# EAGLE schematic A20-SOM-EVB_Rev_C1 (EAGLE 4.16)
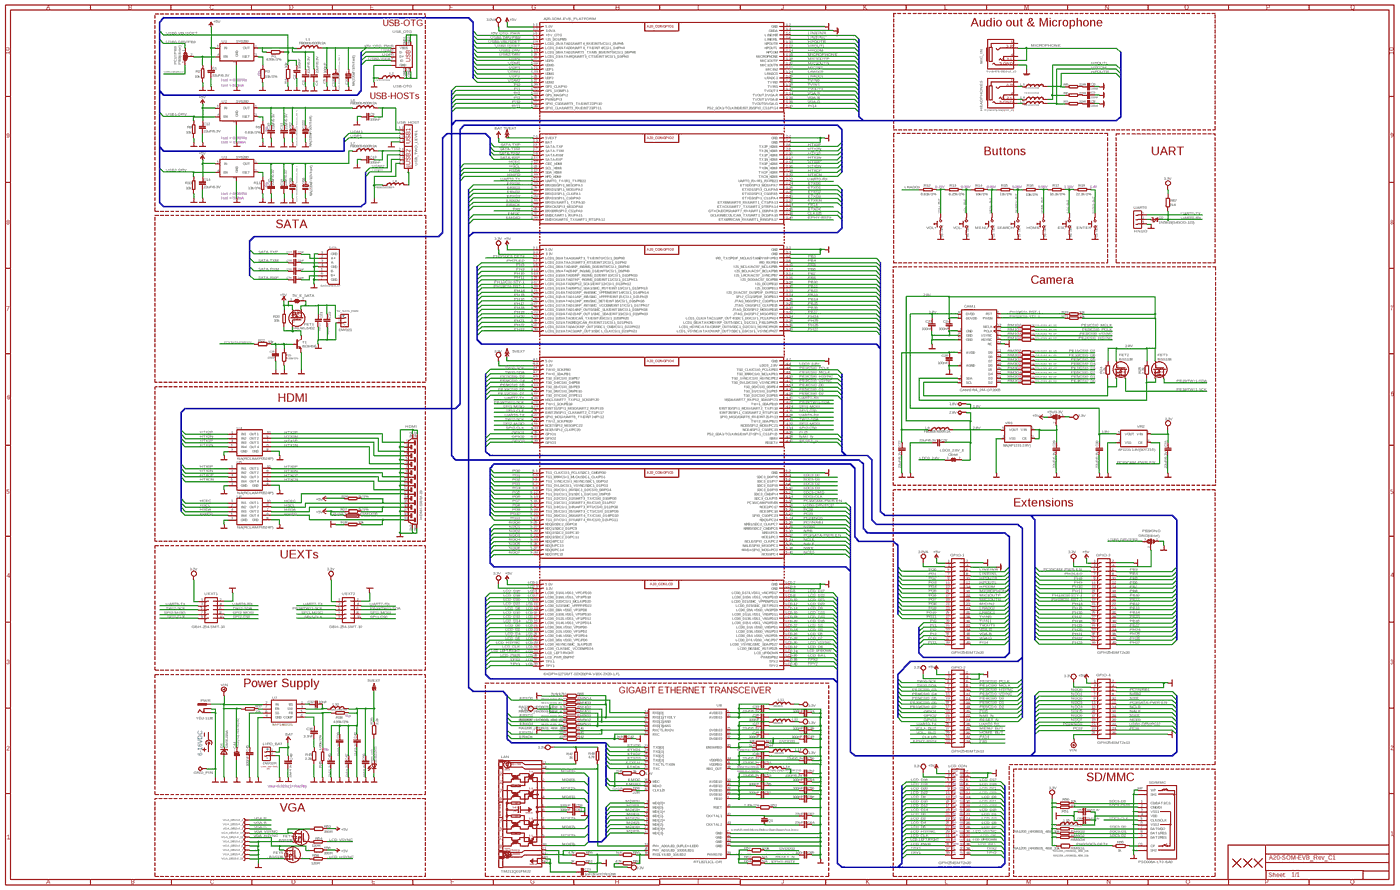
[diagram p0: schematic, sheet 1, overview]
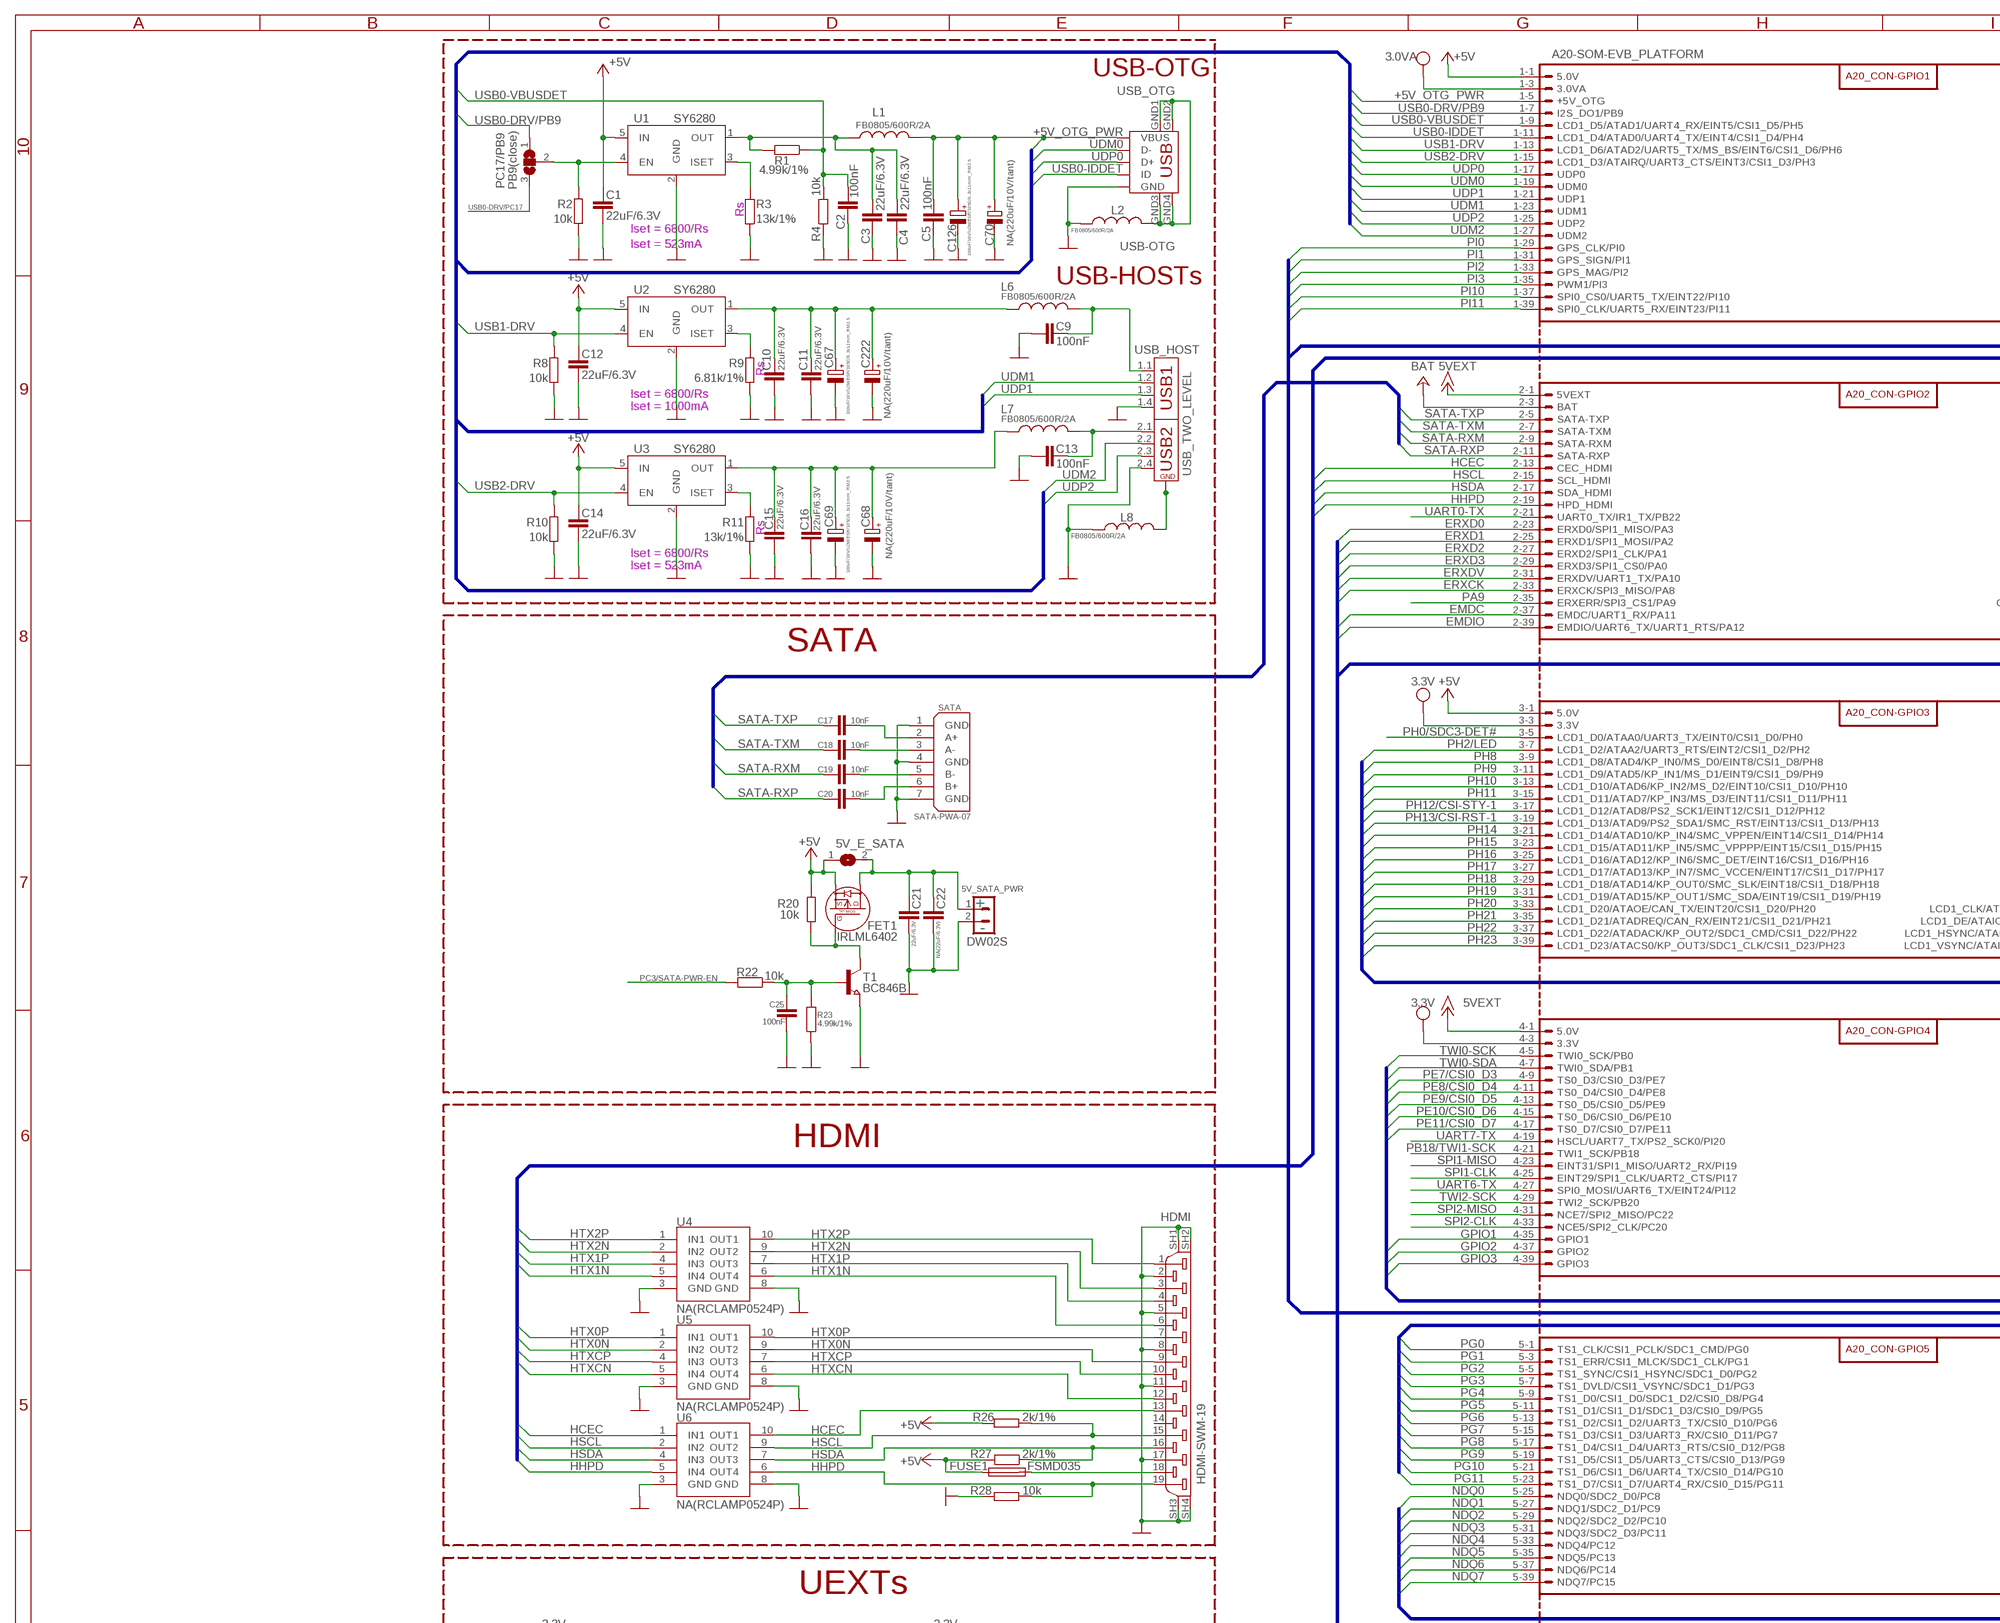
[diagram p1: schematic, sheet 1, part 1 of 4]
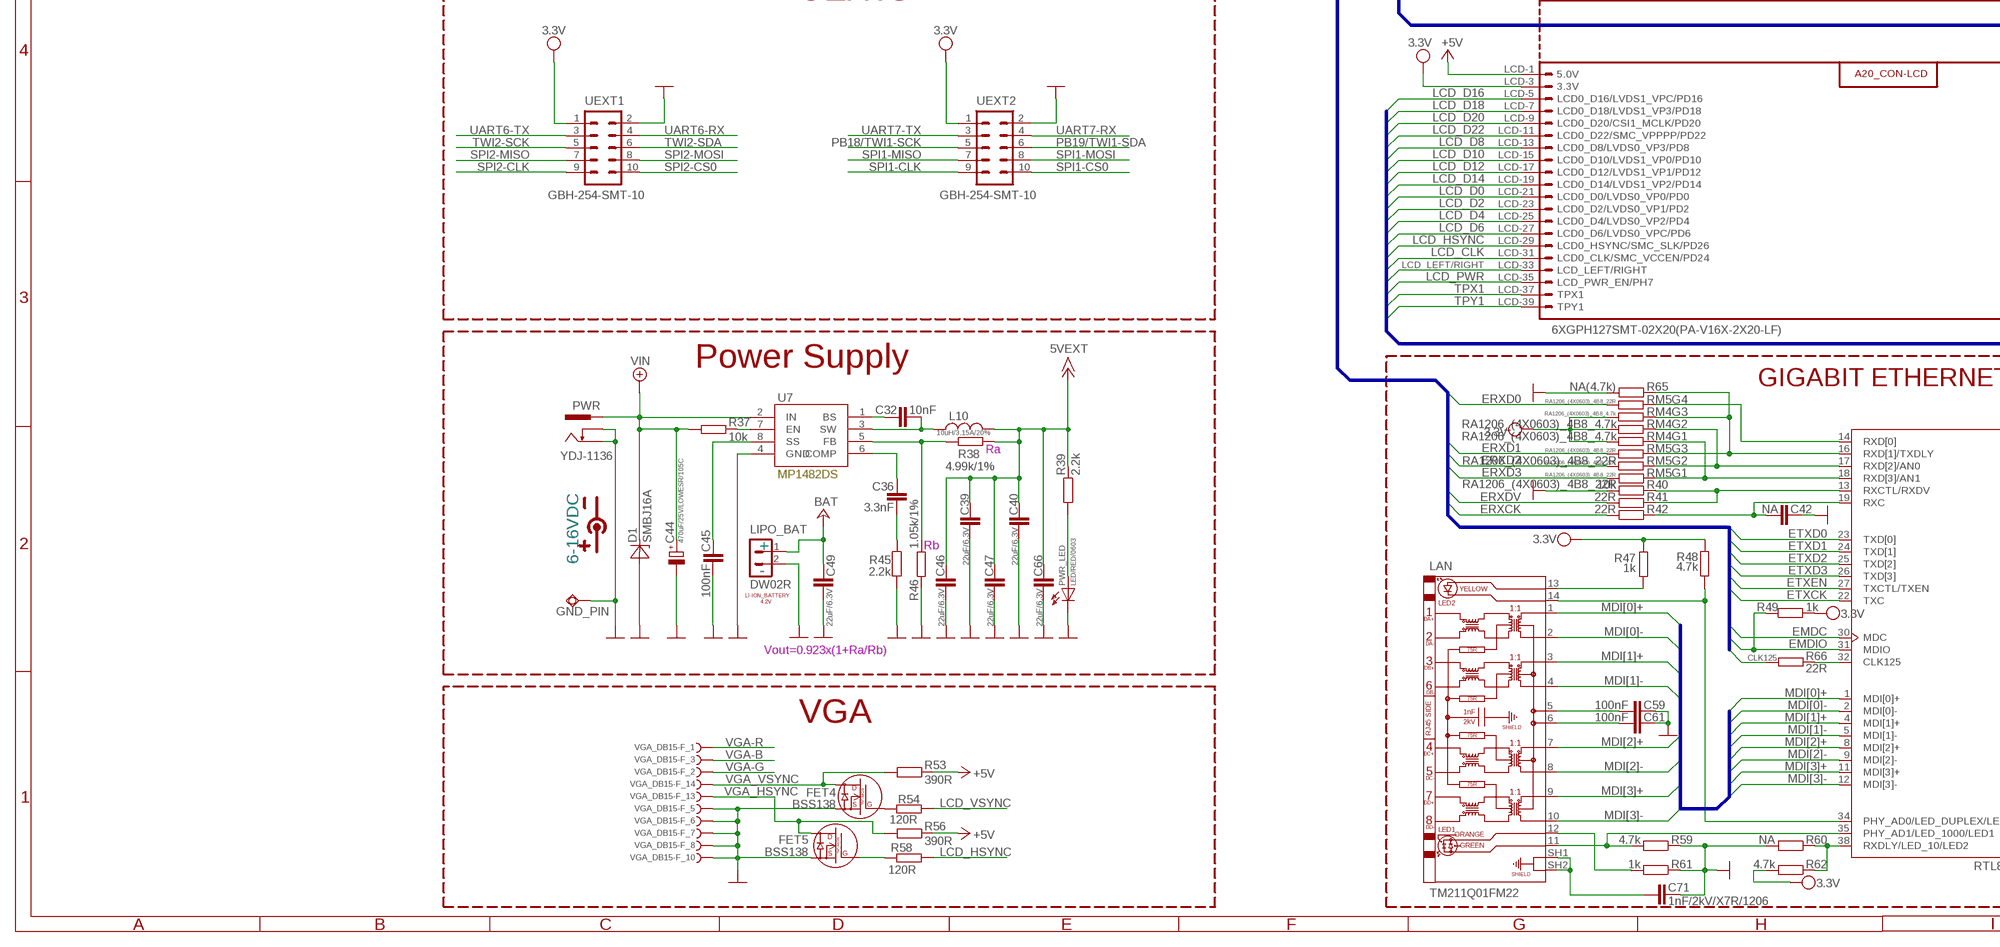
[diagram p2: schematic, sheet 1, part 2 of 4]
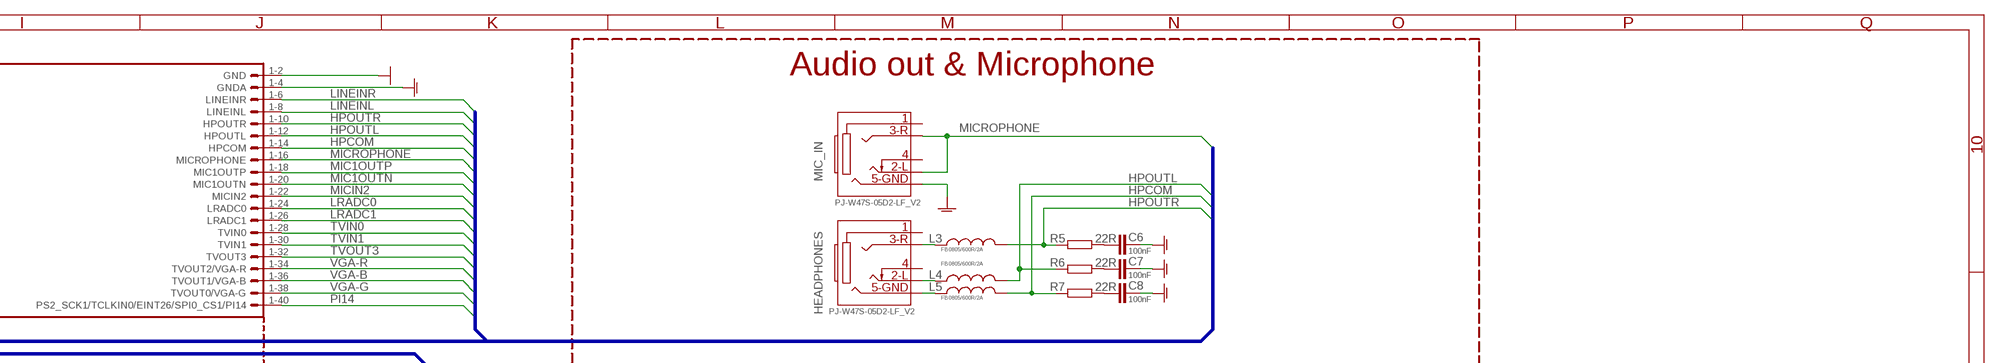
[diagram p3: schematic, sheet 1, part 3 of 4]
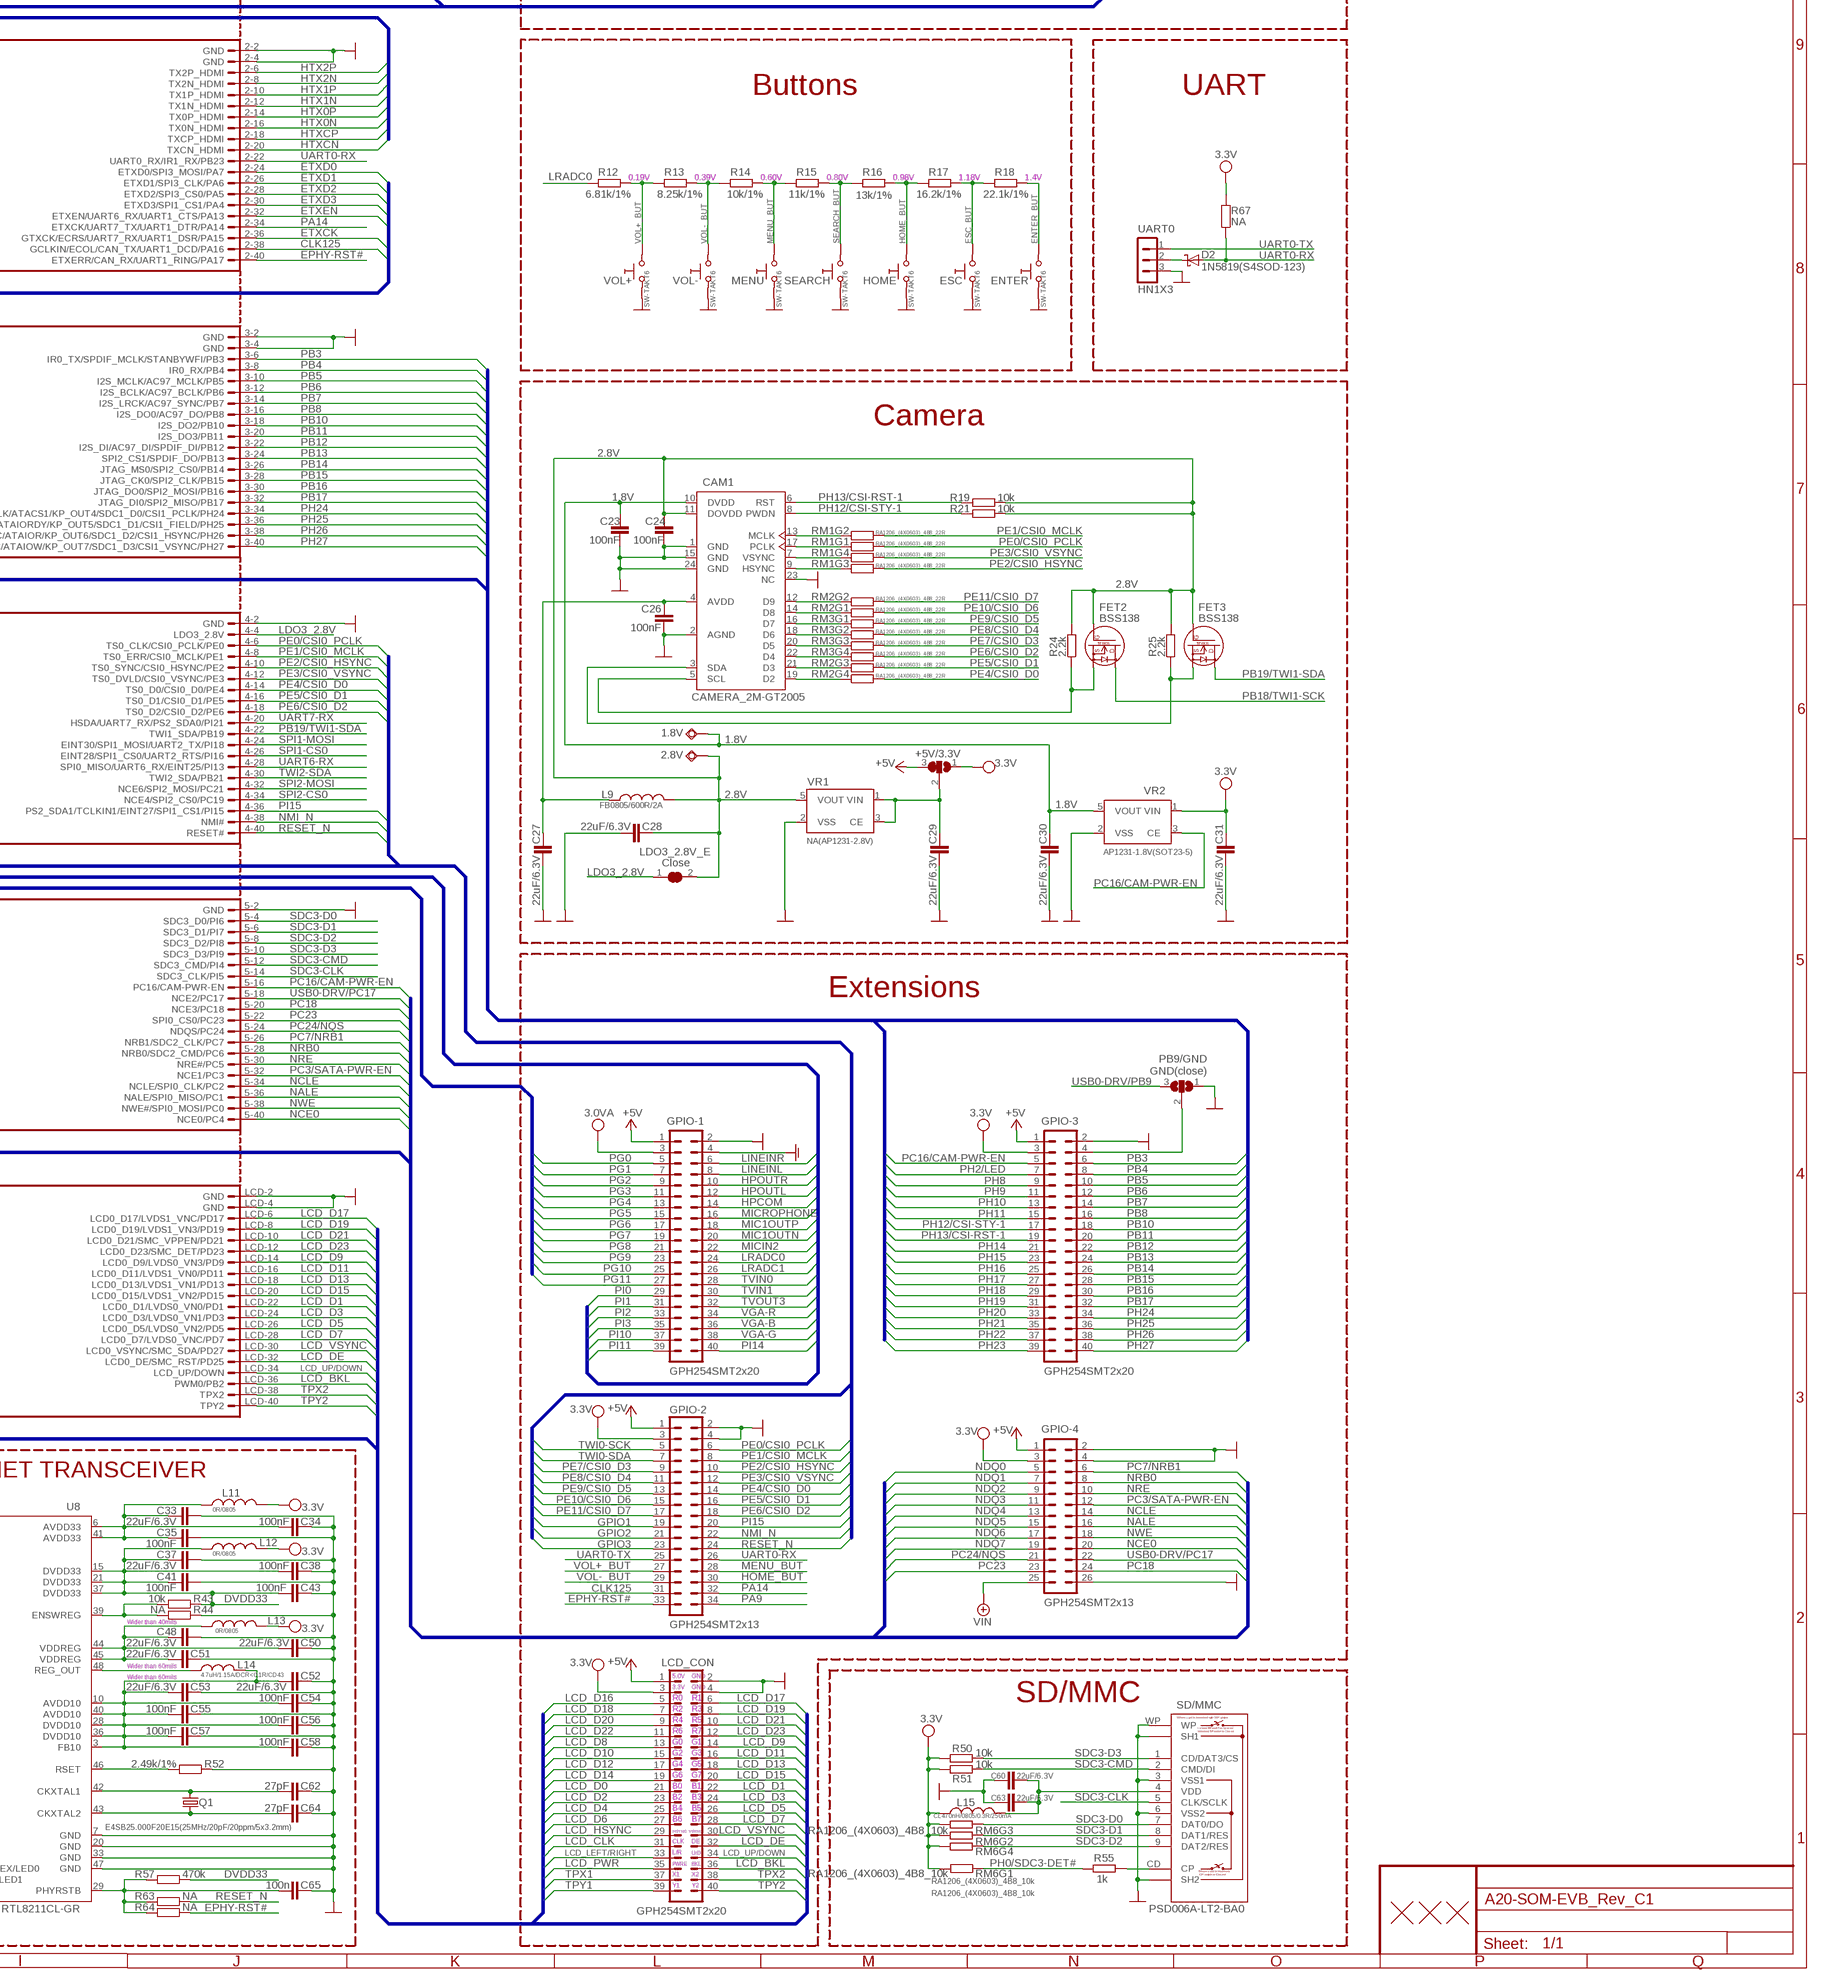
[diagram p4: schematic, sheet 1, part 4 of 4]

## Parts
1.8V  TESTPAD80/40  [SMD80/40]
2.8V  TESTPAD80/40  [SMD80/40]
5V_E_SATA  SJSJ_SMALLER  [SJ_1_SMALLER]
5V_SATA_PWR  DW02S  CON2DW02S  [DW02S]
+5V/3.3V  SJ2W8  [SJ_2_SMALLER_23_TIED]
A20-SOM-EVB_PLATFORM  6XGPH127SMT-02X20(PA-V16X-2X20-LF)  A20-SOM-EVB---6XGPH127SMT-02X20(PA-V16X-2X20-LF)  [A20-SOM-EVB]
C1  22uF/6.3V  C-EUC0603_DWS  [C0603_DWS]
C2  100nF  C-EUC0603_DWS  [C0603_DWS]
C3  22uF/6.3V  C-EUC0603_DWS  [C0603_DWS]
C4  22uF/6.3V  C-EUC0603_DWS  [C0603_DWS]
C5  100nF  C-EUC0603_DWS  [C0603_DWS]
C6  100nF  C-EUC0603_DWS  [C0603_DWS]
C7  100nF  C-EUC0603_DWS  [C0603_DWS]
C8  100nF  C-EUC0603_DWS  [C0603_DWS]
C9  100nF  C-EUC0603_DWS  [C0603_DWS]
C10  22uF/6.3V  C-EUC0603_DWS  [C0603_DWS]
C11  22uF/6.3V  C-EUC0603_DWS  [C0603_DWS]
C12  22uF/6.3V  C-EUC0603_DWS  [C0603_DWS]
C13  100nF  C-EUC0603_DWS  [C0603_DWS]
C14  22uF/6.3V  C-EUC0603_DWS  [C0603_DWS]
C15  22uF/6.3V  C-EUC0603_DWS  [C0603_DWS]
C16  22uF/6.3V  C-EUC0603_DWS  [C0603_DWS]
C17  10nF  C-EUC0603_DWS  [C0603_DWS]
C18  10nF  C-EUC0603_DWS  [C0603_DWS]
C19  10nF  C-EUC0603_DWS  [C0603_DWS]
C20  10nF  C-EUC0603_DWS  [C0603_DWS]
C21  22uF/6.3V  C-EUC0603_DWS  [C0603_DWS]
C22  NA(22uF/6.3V)  C-EUC0603_DWS  [C0603_DWS]
C23  100nF  C-EUC0603_DWS  [C0603_DWS]
C24  100nF  C-EUC0603_DWS  [C0603_DWS]
C25  100nF  C-EUC0603_DWS  [C0603_DWS]
C26  100nF  C-EUC0603_DWS  [C0603_DWS]
C27  22uF/6.3V  C-EUC0603_DWS  [C0603_DWS]
C28  22uF/6.3V  C-EUC0603_DWS  [C0603_DWS]
C29  22uF/6.3V  C-EUC0603_DWS  [C0603_DWS]
C30  22uF/6.3V  C-EUC0603_DWS  [C0603_DWS]
C31  22uF/6.3V  C-EUC0603_DWS  [C0603_DWS]
C32  10nF  C-EUC0603_DWS  [C0603_DWS]
C33  22uF/6.3V  C-EUC0603_DWS  [C0603_DWS]
C34  100nF  C-EUC0603_DWS  [C0603_DWS]
C35  100nF  C-EUC0603_DWS  [C0603_DWS]
C36  3.3nF  C-EUC0603_DWS  [C0603_DWS]
C37  22uF/6.3V  C-EUC0603_DWS  [C0603_DWS]
C38  100nF  C-EUC0603_DWS  [C0603_DWS]
C39  22uF/6.3V  C-EUC0603_DWS  [C0603_DWS]
C40  22uF/6.3V  C-EUC0603_DWS  [C0603_DWS]
C41  100nF  C-EUC0603_DWS  [C0603_DWS]
C42  NA  C-EUC0603_DWS  [C0603_DWS]
C43  100nF  C-EUC0603_DWS  [C0603_DWS]
C44  470uF/25V/LOWESR/105C  CPOL-EUE3.5-8  [E3,5-8]
C45  100nF  C-EUC0603_DWS  [C0603_DWS]
C46  22uF/6.3V  C-EUC0603_DWS  [C0603_DWS]
C47  22uF/6.3V  C-EUC0603_DWS  [C0603_DWS]
C48  22uF/6.3V  C-EUC0603_DWS  [C0603_DWS]
C49  22uF/6.3V  C-EUC0603_DWS  [C0603_DWS]
C50  22uF/6.3V  C-EUC0603_DWS  [C0603_DWS]
C51  22uF/6.3V  C-EUC0603_DWS  [C0603_DWS]
C52  22uF/6.3V  C-EUC0603_DWS  [C0603_DWS]
C53  22uF/6.3V  C-EUC0603_DWS  [C0603_DWS]
C54  100nF  C-EUC0603_DWS  [C0603_DWS]
C55  100nF  C-EUC0603_DWS  [C0603_DWS]
C56  100nF  C-EUC0603_DWS  [C0603_DWS]
C57  100nF  C-EUC0603_DWS  [C0603_DWS]
C58  100nF  C-EUC0603_DWS  [C0603_DWS]
C59  100nF  C-EUC0603_DWS  [C0603_DWS]
C60  22uF/6.3V  C-EUC0603_DWS  [C0603_DWS]
C61  100nF  C-EUC0603_DWS  [C0603_DWS]
C62  27pF  C-EUC0603_DWS  [C0603_DWS]
C63  22uF/6.3V  C-EUC0603_DWS  [C0603_DWS]
C64  27pF  C-EUC0603_DWS  [C0603_DWS]
C65  100n  C-EUC0603_DWS  [C0603_DWS]
C66  22uF/6.3V  C-EUC0603_DWS  [C0603_DWS]
C67  100uF/16V/LOWESR/105C/6.3x11mm_RM2.5  CPOL-EUE2.5-6.3  [E2,5-6,3]
C68  NA(220uF/10V/tant)  CPOL-EUCT7343  [CT7343]
C69  100uF/16V/LOWESR/105C/6.3x11mm_RM2.5  CPOL-EUE2.5-6.3  [E2,5-6,3]
C70  NA(220uF/10V/tant)  CPOL-EUCT7343  [CT7343]
C71  1nF/2kV/X7R/1206  C-EUC1206_5MILS_WS_ISO  [C1206_5MILS_WS_ISO]
C126  100uF/16V/LOWESR/105C/6.3x11mm_RM2.5  CPOL-EUE2.5-6.3  [E2,5-6,3]
C222  NA(220uF/10V/tant)  CPOL-EUCT7343  [CT7343]
CAM1  CAMERA_2M-GT2005  [CAM_2M_GT2005]
D1  SMBJ16A  [DO214AA]
D2  1N5819(S4SOD-123)  SCHOTKKY7.62SS-1N5819(S4SOD-123)  [SOD-123]
ENTER  SW-TAKT6  [SW-TAKT_6X3.5_SMD]
ESC  SW-TAKT6  [SW-TAKT_6X3.5_SMD]
FET1  IRLML6402  P-MOS+DIODIRLML6402  [SOT23]
FET2  BSS138  N-MOS+DIODBSS138(SOT23-3)  [SOT23]
FET3  BSS138  N-MOS+DIODBSS138(SOT23-3)  [SOT23]
FET4  BSS138  N-MOS+DIODBSS138(SOT23-3)  [SOT23]
FET5  BSS138  N-MOS+DIODBSS138(SOT23-3)  [SOT23]
FID1  FIDUCIAL  [FIDUCIAL-1X3]
FID2  FIDUCIAL  [FIDUCIAL-1X3]
FID3  FIDUCIAL  [FIDUCIAL-1X3]
FUSE1  FSMD035  FUSE  [1206]
GND_PIN  TESTPAD3  [TEST_PAD40/70/SQUARE]
GPIO-1  GPH254SMT2x20  ML40-GBH-254-SMT-40  [ML40-MALE(GBH-254-SMT-40)]
GPIO-2  GPH254SMT2x13  ML34-(GBH-254-SMT-34)  [ML34-MALE(GBH-254-SMT-34)]
GPIO-3  GPH254SMT2x20  ML40-GBH-254-SMT-40  [ML40-MALE(GBH-254-SMT-40)]
GPIO-4  GPH254SMT2x13  ML26-(GBH-254-SMT-26)  [ML26-MALE(GBH-254-SMT-26)]
HDMI  HDMI-SWM-19  HDMI-MC34931HDMI-SWM-19  [HDMI-SWM-19]
HEADPHONES  PJ-W47S-05D2-LF_V2  AUDIO_JACK_5PINPJ-W47S-05D2-LF_V2  [PJ-W47S-05D2-LF_5PIN_V2]
HOME  SW-TAKT6  [SW-TAKT_6X3.5_SMD]
L1  FB0805/600R/2A  L-USL0805_5MIL_DWS  [L0805_5MIL_DWS]
L2  FB0805/600R/2A  L-USL0805_5MIL_DWS  [L0805_5MIL_DWS]
L3  FB0805/600R/2A  L-USL0805_5MIL_DWS  [L0805_5MIL_DWS]
L4  FB0805/600R/2A  L-USL0805_5MIL_DWS  [L0805_5MIL_DWS]
L5  FB0805/600R/2A  L-USL0805_5MIL_DWS  [L0805_5MIL_DWS]
L6  FB0805/600R/2A  L-USL0805_5MIL_DWS  [L0805_5MIL_DWS]
L7  FB0805/600R/2A  L-USL0805_5MIL_DWS  [L0805_5MIL_DWS]
L8  FB0805/600R/2A  L-USL0805_5MIL_DWS  [L0805_5MIL_DWS]
L9  FB0805/600R/2A  L-USL0805_5MIL_DWS  [L0805_5MIL_DWS]
L10  10uH/3.15A/20%  LL  [8X7MM_3131]
L11  0R/0805  L-USL0805_5MIL_DWS  [L0805_5MIL_DWS]
L12  0R/0805  L-USL0805_5MIL_DWS  [L0805_5MIL_DWS]
L13  0R/0805  L-USL0805_5MIL_DWS  [L0805_5MIL_DWS]
L14  4.7uH/1.15A/DCR<0.1R/CD43  L-CD42(43)  [CD42(43)]
L15  CL470nH/0805/0.3R/250mA  L-USL0805_5MIL_DWS  [L0805_5MIL_DWS]
LAN  TM211Q01FM22  TM211Q01FM22_SH  [TM211Q01FM22_SH]
LCD_CON  GPH254SMT2x20  ML40-GBH-254-SMT-40  [ML40-MALE(GBH-254-SMT-40)]
LDO3_2.8V_E  Close  SJSJ_1_SMALLER_CLOSE  [SJ_1_SMALLER_CLOSE]
LIPO_BAT  DW02R  CON2DW02R  [DW02R]
MENU  SW-TAKT6  [SW-TAKT_6X3.5_SMD]
MIC_IN  PJ-W47S-05D2-LF_V2  AUDIO_JACK_5PINPJ-W47S-05D2-LF_V2  [PJ-W47S-05D2-LF_5PIN_V2]
PB9/GND  GND(close)  SJ2W3  [SJ_2_SMALL]
PC17/PB9  PB9(close)  SJ2W3  [SJ_2_SMALL]
PWR  YDJ-1136  PWR-JAKPWR_JACK_UNI_MILLING  [PWR_JACK_UNI_MILLING]
PWR_LED  LED/RED/0603  LED0603DWS  [LED-0603]
Q1  E4SB25.000F20E15(25MHz/20pF/20ppm/5x3.2mm)  HC49/S_E4SB25.000F20E15  [HCX-4S]
R1  4.99k/1%  R-EU_R0603_5MIL_DWS  [R0603_5MIL_DWS]
R2  10k  R-EU_R0603_5MIL_DWS  [R0603_5MIL_DWS]
R3  13k/1%  R-EU_R0603_5MIL_DWS  [R0603_5MIL_DWS]
R4  10k  R-EU_R0603_5MIL_DWS  [R0603_5MIL_DWS]
R5  22R  R-EU_R0603_5MIL_DWS  [R0603_5MIL_DWS]
R6  22R  R-EU_R0603_5MIL_DWS  [R0603_5MIL_DWS]
R7  22R  R-EU_R0603_5MIL_DWS  [R0603_5MIL_DWS]
R8  10k  R-EU_R0603_5MIL_DWS  [R0603_5MIL_DWS]
R9  6.81k/1%  R-EU_R0603_5MIL_DWS  [R0603_5MIL_DWS]
R10  10k  R-EU_R0603_5MIL_DWS  [R0603_5MIL_DWS]
R11  13k/1%  R-EU_R0603_5MIL_DWS  [R0603_5MIL_DWS]
R12  6.81k/1%  R-EU_R0603_5MIL_DWS  [R0603_5MIL_DWS]
R13  8.25k/1%  R-EU_R0603_5MIL_DWS  [R0603_5MIL_DWS]
R14  10k/1%  R-EU_R0603_5MIL_DWS  [R0603_5MIL_DWS]
R15  11k/1%  R-EU_R0603_5MIL_DWS  [R0603_5MIL_DWS]
R16  13k/1%  R-EU_R0603_5MIL_DWS  [R0603_5MIL_DWS]
R17  16.2k/1%  R-EU_R0603_5MIL_DWS  [R0603_5MIL_DWS]
R18  22.1k/1%  R-EU_R0603_5MIL_DWS  [R0603_5MIL_DWS]
R19  10k  R-EU_R0603_5MIL_DWS  [R0603_5MIL_DWS]
R20  10k  R-EU_R0603_5MIL_DWS  [R0603_5MIL_DWS]
R21  10k  R-EU_R0603_5MIL_DWS  [R0603_5MIL_DWS]
R22  10k  R-EU_R0603_5MIL_DWS  [R0603_5MIL_DWS]
R23  4.99k/1%  R-EU_R0603_5MIL_DWS  [R0603_5MIL_DWS]
R24  2.2k  R-EU_R0603_5MIL_DWS  [R0603_5MIL_DWS]
R25  2.2k  R-EU_R0603_5MIL_DWS  [R0603_5MIL_DWS]
R26  2k/1%  R-EU_R0603_5MIL_DWS  [R0603_5MIL_DWS]
R27  2k/1%  R-EU_R0603_5MIL_DWS  [R0603_5MIL_DWS]
R28  10k  R-EU_R0603_5MIL_DWS  [R0603_5MIL_DWS]
R37  10k  R-EU_R0603_5MIL_DWS  [R0603_5MIL_DWS]
R38  4.99k/1%  R-EU_R0603_5MIL_DWS  [R0603_5MIL_DWS]
R39  2.2k  R-EU_R0603_5MIL_DWS  [R0603_5MIL_DWS]
R40  10k  R-EU_R0603_5MIL_DWS  [R0603_5MIL_DWS]
R41  22R  R-EU_R0603_5MIL_DWS  [R0603_5MIL_DWS]
R42  22R  R-EU_R0603_5MIL_DWS  [R0603_5MIL_DWS]
R43  10k  R-EU_R0603_5MIL_DWS  [R0603_5MIL_DWS]
R44  NA  R-EU_R0603_5MIL_DWS  [R0603_5MIL_DWS]
R45  2.2k  R-EU_R0603_5MIL_DWS  [R0603_5MIL_DWS]
R46  1.05k/1%  R-EU_R0603_5MIL_DWS  [R0603_5MIL_DWS]
R47  1k  R-EU_R0603_5MIL_DWS  [R0603_5MIL_DWS]
R48  4.7k  R-EU_R0603_5MIL_DWS  [R0603_5MIL_DWS]
R49  1k  R-EU_R0603_5MIL_DWS  [R0603_5MIL_DWS]
R50  10k  R-EU_R0603_5MIL_DWS  [R0603_5MIL_DWS]
R51  10k  R-EU_R0603_5MIL_DWS  [R0603_5MIL_DWS]
R52  2.49k/1%  R-EU_R0603_5MIL_DWS  [R0603_5MIL_DWS]
R53  390R  R-EU_R0603_5MIL_DWS  [R0603_5MIL_DWS]
R54  120R  R-EU_R0603_5MIL_DWS  [R0603_5MIL_DWS]
R55  1k  R-EU_R0603_5MIL_DWS  [R0603_5MIL_DWS]
R56  390R  R-EU_R0603_5MIL_DWS  [R0603_5MIL_DWS]
R57  470k  R-EU_R0603_5MIL_DWS  [R0603_5MIL_DWS]
R58  120R  R-EU_R0603_5MIL_DWS  [R0603_5MIL_DWS]
R59  4.7k  R-EU_R0603_5MIL_DWS  [R0603_5MIL_DWS]
R60  NA  R-EU_R0603_5MIL_DWS  [R0603_5MIL_DWS]
R61  1k  R-EU_R0603_5MIL_DWS  [R0603_5MIL_DWS]
R62  4.7k  R-EU_R0603_5MIL_DWS  [R0603_5MIL_DWS]
R63  NA  R-EU_R0603_5MIL_DWS  [R0603_5MIL_DWS]
R64  NA  R-EU_R0603_5MIL_DWS  [R0603_5MIL_DWS]
R65  NA(4.7k)  R-EU_R0603_5MIL_DWS  [R0603_5MIL_DWS]
R66  22R  R-EU_R0603_5MIL_DWS  [R0603_5MIL_DWS]
R67  NA  R-EU_R0603_5MIL_DWS  [R0603_5MIL_DWS]
RM1  RA1206_(4X0603)_4B8_22R  R_MATRIX_4E  [R_MATRIX_4]
RM2  RA1206_(4X0603)_4B8_22R  R_MATRIX_4E  [R_MATRIX_4]
RM3  RA1206_(4X0603)_4B8_22R  R_MATRIX_4E  [R_MATRIX_4]
RM4  RA1206_(4X0603)_4B8_4.7k  R_MATRIX_4E  [R_MATRIX_4]
RM5  RA1206_(4X0603)_4B8_22R  R_MATRIX_4E  [R_MATRIX_4]
RM6  RA1206_(4X0603)_4B8_10k  R_MATRIX_4E  [R_MATRIX_4]
SATA  SATA-PWA-07  [SATA-PWA-07]
SD/MMC  PSD006A-LT2-BA0  SD_CARD_PSD006A-LT2-BA0  [SD_CARD]
SEARCH  SW-TAKT6  [SW-TAKT_6X3.5_SMD]
T1  BC846B  NPN-TRANSISTOR_SOT23  [SOT23]
U1  SY6280  [SOT23-5]
U2  SY6280  [SOT23-5]
U3  SY6280  [SOT23-5]
U4  NA(RCLAMP0524P)  RCLAMP0524P  [SLP2510P8]
U5  NA(RCLAMP0524P)  RCLAMP0524P  [SLP2510P8]
U6  NA(RCLAMP0524P)  RCLAMP0524P  [SLP2510P8]
U7  MP1482DS  MP1482  [SOIC8]
U8  RTL8211CL-GR  [LQFP48]
UART0  HN1X3  CON3HN1X3  [HN1X3]
UEXT1  GBH-254-SMT-10  ML10MD  [ML10_S]
UEXT2  GBH-254-SMT-10  ML10MD  [ML10_S]
USB_HOST  USB_TWO_LEVEL  [USB_TWO_LEVEL]
USB_OTG  USB-OTG  MINI_USB9  [USB_MINI_9PIN]
VGA_DB15-F  VGA15  DB1522  [DB15-F_22MM]
VOL+  SW-TAKT6  [SW-TAKT_6X3.5_SMD]
VOL-  SW-TAKT6  [SW-TAKT_6X3.5_SMD]
VR1  NA(AP1231-2.8V)  AP1231-33  [SOT-23-5]
VR2  AP1231-1.8V(SOT23-5)  AP1231-33  [SOT-23-5]

## Nets
1.8V [pwr]: 1.8V.P$1(PP) C23.1 C30.1 CAM1.10(DVDD) VR2.5(VOUT)
2.8V: 2.8V.P$1(PP) C24.1 C28.1 CAM1.11(DOVDD) FET2.1(G) FET3.1(G) L9.2 LDO3_2.8V_E.2 R19.2 R21.2 R24.2 R25.2 VR1.5(VOUT)
+5V: 5V_E_SATA.1 +5V/3.3V.3 A20-SOM-EVB_PLATFORM.1-1(5.0V) A20-SOM-EVB_PLATFORM.3-1(5.0V) A20-SOM-EVB_PLATFORM.LCD-1(5.0V) C1.1 C12.1 C14.1 FET1.2(S) FUSE1.1 GPIO-1.1 GPIO-2.1 GPIO-3.1 GPIO-4.1 LCD_CON.1 R20.1 R26.2 R27.2 R53.1 R56.1 U1.5(IN) U2.5(IN) U3.5(IN)
+5V_OTG_PWR: A20-SOM-EVB_PLATFORM.1-5(+5V_OTG) C5.1 C70.+ C126.+ L1.1 USB_OTG.VBUS
+12V: C44.+ D1.C GPIO-4.25 PWR.+ R37.1 U7.2(IN) ; supply symbol labelled VIN
+15V: A20-SOM-EVB_PLATFORM.2-1(5VEXT) A20-SOM-EVB_PLATFORM.4-1(5.0V) C39.1 C40.1 C46.1 C47.1 C66.1 L10.2 R38.2 R39.1 ; supply symbol labelled 5VEXT
+24V: A20-SOM-EVB_PLATFORM.2-3(BAT) C49.2 LIPO_BAT.1 ; supply symbol labelled BAT
AVDD1: C26.1 C27.1 CAM1.4(AVDD) L9.1
AVDD33: C33.2 C34.2 C35.2 L11.2 U8.6(AVDD33) U8.41(AVDD33)
AVDD/DVDD(1.05V): C52.2 C53.2 C54.2 C55.2 C56.2 C57.2 C58.2 L14.2 U8.3(FB10) U8.10(AVDD10) U8.28(DVDD10) U8.36(DVDD10) U8.40(AVDD10)
CLK125: A20-SOM-EVB_PLATFORM.2-38(GCLKIN/ECOL/CAN_TX/UART1_DCD/PA16) GPIO-2.31 R66.1
DVDD33: C37.2 C38.2 C41.2 C43.2 L12.2 R43.1 R57.1 U8.15(DVDD33) U8.21(DVDD33) U8.37(DVDD33)
EMDC: A20-SOM-EVB_PLATFORM.2-37(EMDC/UART1_RX/PA11) U8.30(MDC)
EMDIO: A20-SOM-EVB_PLATFORM.2-39(EMDIO/UART6_TX/UART1_RTS/PA12) R49.1 U8.31(MDIO)
ENTER_BUT: ENTER.P$2 R18.2
EPHY-RST#: A20-SOM-EVB_PLATFORM.2-40(ETXERR/CAN_RX/UART1_RING/PA17) GPIO-2.33 R64.1
ERXCK: A20-SOM-EVB_PLATFORM.2-33(ERXCK/SPI3_MISO/PA8) R42.2
ERXD0: A20-SOM-EVB_PLATFORM.2-23(ERXD0/SPI1_MISO/PA3) RM5.4.2
ERXD1: A20-SOM-EVB_PLATFORM.2-25(ERXD1/SPI1_MOSI/PA2) RM5.3.2
ERXD2: A20-SOM-EVB_PLATFORM.2-27(ERXD2/SPI1_CLK/PA1) RM5.2.2
ERXD3: A20-SOM-EVB_PLATFORM.2-29(ERXD3/SPI1_CS0/PA0) RM5.1.2
ERXDV: A20-SOM-EVB_PLATFORM.2-31(ERXDV/UART1_TX/PA10) R41.2
ESC_BUT: ESC.P$2 R17.2 R18.1
ETXCK: A20-SOM-EVB_PLATFORM.2-36(GTXCK/ECRS/UART7_RX/UART1_DSR/PA15) U8.22(TXC)
ETXD0: A20-SOM-EVB_PLATFORM.2-24(ETXD0/SPI3_MOSI/PA7) U8.23(TXD[0])
ETXD1: A20-SOM-EVB_PLATFORM.2-26(ETXD1/SPI3_CLK/PA6) U8.24(TXD[1])
ETXD2: A20-SOM-EVB_PLATFORM.2-28(ETXD2/SPI3_CS0/PA5) U8.25(TXD[2])
ETXD3: A20-SOM-EVB_PLATFORM.2-30(ETXD3/SPI1_CS1/PA4) U8.26(TXD[3])
ETXEN: A20-SOM-EVB_PLATFORM.2-32(ETXEN/UART6_RX/UART1_CTS/PA13) U8.27(TXCTL/TXEN)
GND [pwr]: 5V_SATA_PWR.2 A20-SOM-EVB_PLATFORM.1-2(GND) A20-SOM-EVB_PLATFORM.2-2(GND) A20-SOM-EVB_PLATFORM.2-4(GND) A20-SOM-EVB_PLATFORM.3-2(GND) A20-SOM-EVB_PLATFORM.3-4(GND) A20-SOM-EVB_PLATFORM.4-2(GND) A20-SOM-EVB_PLATFORM.5-2(GND) A20-SOM-EVB_PLATFORM.LCD-2(GND) A20-SOM-EVB_PLATFORM.LCD-4(GND) C1.2 C2.2 C3.2 C4.2 C5.2 C9.2 C10.2 C11.2 C12.2 C13.2 C14.2 C15.2 C16.2 C21.1 C22.1 C23.2 C24.2 C25.2 C26.2 C27.2 C28.2 C29.2 C30.2 C31.2 C33.1 C34.1 C35.1 C37.1 C38.1 C39.2 C40.2 C41.1 C42.2 C43.1 C44.- C45.2 C46.2 C47.2 C48.1 C49.1 C50.1 C51.1 C52.1 C53.1 C54.1 C55.1 C56.1 C57.1 C58.1 C59.1 C60.1 C61.1 C62.1 C63.1 C64.1 C65.1 C66.2 C67.- C68.- C69.- C70.- C71.1 C126.- C222.- CAM1.1(GND) CAM1.2(AGND) CAM1.15(GND) CAM1.23(NC) CAM1.24(GND) D1.A ENTER.P$1 ESC.P$1 FET4.2(S) FET5.2(S) GND_PIN.P$1(PP) GPIO-1.2 GPIO-2.2 GPIO-2.4 GPIO-3.2 GPIO-4.2 GPIO-4.4 GPIO-4.26 HDMI.2 HDMI.5 HDMI.8 HDMI.11 HDMI.17 HDMI.SH1 HDMI.SH2 HDMI.SH3 HDMI.SH4 HOME.P$1 L2.1 L8.1 LCD_CON.2 LCD_CON.4 LIPO_BAT.2 MENU.P$1 PB9/GND.1 PWR.- PWR.-- PWR_LED.C R2.1 R3.1 R4.1 R8.1 R9.1 R10.1 R11.1 R23.1 R28.2 R40.2 R44.1 R45.2 R46.2 R52.1 R59.1 R60.2 R61.1 R65.2 SATA.1(GND) SATA.4(GND) SATA.7(GND) SD/MMC.3(VSS1) SD/MMC.6(VSS2) SD/MMC.SH1 SD/MMC.SH2 SD/MMC.WP SEARCH.P$1 T1.2(E) U1.2(GND) U2.2(GND) U3.2(GND) U4.3(GND) U4.8(GND) U5.3(GND) U5.8(GND) U6.3(GND) U6.8(GND) U7.4(GND) U8.7(GND) U8.20(GND) U8.33(GND) U8.47(GND) UART0.3 UEXT1.2 UEXT2.2 USB_HOST.1.4 USB_HOST.2.4 USB_OTG.GND VGA_DB15-F.5 VGA_DB15-F.6 VGA_DB15-F.7 VGA_DB15-F.8 VGA_DB15-F.10 VOL+.P$1 VOL-.P$1 VR1.2(VSS) VR2.2(VSS)
GNDA: A20-SOM-EVB_PLATFORM.1-4(GNDA) C6.1 C7.1 C8.1 GPIO-1.4 MIC_IN.5
GPIO1: A20-SOM-EVB_PLATFORM.4-35(GPIO1) GPIO-2.19
GPIO2: A20-SOM-EVB_PLATFORM.4-37(GPIO2) GPIO-2.21
GPIO3: A20-SOM-EVB_PLATFORM.4-39(GPIO3) GPIO-2.23
HCEC: A20-SOM-EVB_PLATFORM.2-13(CEC_HDMI) HDMI.13 U6.1(IN1) U6.10(OUT1)
HDMI_5V_SOURCE: FUSE1.2 HDMI.18
HHPD: A20-SOM-EVB_PLATFORM.2-19(HPD_HDMI) HDMI.19 R28.1 U6.5(IN4) U6.6(OUT4)
HOME_BUT: GPIO-2.30 HOME.P$2 R16.2 R17.1
HPCOM: A20-SOM-EVB_PLATFORM.1-14(HPCOM) GPIO-1.14 L5.1 R7.2
HPOUTL: A20-SOM-EVB_PLATFORM.1-12(HPOUTL) GPIO-1.12 L4.1 R6.2
HPOUTR: A20-SOM-EVB_PLATFORM.1-10(HPOUTR) GPIO-1.10 L3.1 R5.2
HSCL: A20-SOM-EVB_PLATFORM.2-15(SCL_HDMI) HDMI.15 R26.1 U6.2(IN2) U6.9(OUT2)
HSDA: A20-SOM-EVB_PLATFORM.2-17(SDA_HDMI) HDMI.16 R27.1 U6.4(IN3) U6.7(OUT3)
HTX0N: A20-SOM-EVB_PLATFORM.2-16(TX0N_HDMI) HDMI.9 U5.2(IN2) U5.9(OUT2)
HTX0P: A20-SOM-EVB_PLATFORM.2-14(TX0P_HDMI) HDMI.7 U5.1(IN1) U5.10(OUT1)
HTX1N: A20-SOM-EVB_PLATFORM.2-12(TX1N_HDMI) HDMI.6 U4.5(IN4) U4.6(OUT4)
HTX1P: A20-SOM-EVB_PLATFORM.2-10(TX1P_HDMI) HDMI.4 U4.4(IN3) U4.7(OUT3)
HTX2N: A20-SOM-EVB_PLATFORM.2-8(TX2N_HDMI) HDMI.3 U4.2(IN2) U4.9(OUT2)
HTX2P: A20-SOM-EVB_PLATFORM.2-6(TX2P_HDMI) HDMI.1 U4.1(IN1) U4.10(OUT1)
HTXCN: A20-SOM-EVB_PLATFORM.2-20(TXCN_HDMI) HDMI.12 U5.5(IN4) U5.6(OUT4)
HTXCP: A20-SOM-EVB_PLATFORM.2-18(TXCP_HDMI) HDMI.10 U5.4(IN3) U5.7(OUT3)
LCD_BKL: A20-SOM-EVB_PLATFORM.LCD-36(PWM0/PB2) LCD_CON.36
LCD_CLK: A20-SOM-EVB_PLATFORM.LCD-31(LCD0_CLK/SMC_VCCEN/PD24) LCD_CON.31
LCD_D0: A20-SOM-EVB_PLATFORM.LCD-21(LCD0_D0/LVDS0_VP0/PD0) LCD_CON.21
LCD_D1: A20-SOM-EVB_PLATFORM.LCD-22(LCD0_D1/LVDS0_VN0/PD1) LCD_CON.22
LCD_D2: A20-SOM-EVB_PLATFORM.LCD-23(LCD0_D2/LVDS0_VP1/PD2) LCD_CON.23
LCD_D3: A20-SOM-EVB_PLATFORM.LCD-24(LCD0_D3/LVDS0_VN1/PD3) LCD_CON.24
LCD_D4: A20-SOM-EVB_PLATFORM.LCD-25(LCD0_D4/LVDS0_VP2/PD4) LCD_CON.25
LCD_D5: A20-SOM-EVB_PLATFORM.LCD-26(LCD0_D5/LVDS0_VN2/PD5) LCD_CON.26
LCD_D6: A20-SOM-EVB_PLATFORM.LCD-27(LCD0_D6/LVDS0_VPC/PD6) LCD_CON.27
LCD_D7: A20-SOM-EVB_PLATFORM.LCD-28(LCD0_D7/LVDS0_VNC/PD7) LCD_CON.28
LCD_D8: A20-SOM-EVB_PLATFORM.LCD-13(LCD0_D8/LVDS0_VP3/PD8) LCD_CON.13
LCD_D9: A20-SOM-EVB_PLATFORM.LCD-14(LCD0_D9/LVDS0_VN3/PD9) LCD_CON.14
LCD_D10: A20-SOM-EVB_PLATFORM.LCD-15(LCD0_D10/LVDS1_VP0/PD10) LCD_CON.15
LCD_D11: A20-SOM-EVB_PLATFORM.LCD-16(LCD0_D11/LVDS1_VN0/PD11) LCD_CON.16
LCD_D12: A20-SOM-EVB_PLATFORM.LCD-17(LCD0_D12/LVDS1_VP1/PD12) LCD_CON.17
LCD_D13: A20-SOM-EVB_PLATFORM.LCD-18(LCD0_D13/LVDS1_VN1/PD13) LCD_CON.18
LCD_D14: A20-SOM-EVB_PLATFORM.LCD-19(LCD0_D14/LVDS1_VP2/PD14) LCD_CON.19
LCD_D15: A20-SOM-EVB_PLATFORM.LCD-20(LCD0_D15/LVDS1_VN2/PD15) LCD_CON.20
LCD_D16: A20-SOM-EVB_PLATFORM.LCD-5(LCD0_D16/LVDS1_VPC/PD16) LCD_CON.5
LCD_D17: A20-SOM-EVB_PLATFORM.LCD-6(LCD0_D17/LVDS1_VNC/PD17) LCD_CON.6
LCD_D18: A20-SOM-EVB_PLATFORM.LCD-7(LCD0_D18/LVDS1_VP3/PD18) LCD_CON.7
LCD_D19: A20-SOM-EVB_PLATFORM.LCD-8(LCD0_D19/LVDS1_VN3/PD19) LCD_CON.8
LCD_D20: A20-SOM-EVB_PLATFORM.LCD-9(LCD0_D20/CSI1_MCLK/PD20) LCD_CON.9
LCD_D21: A20-SOM-EVB_PLATFORM.LCD-10(LCD0_D21/SMC_VPPEN/PD21) LCD_CON.10
LCD_D22: A20-SOM-EVB_PLATFORM.LCD-11(LCD0_D22/SMC_VPPPP/PD22) LCD_CON.11
LCD_D23: A20-SOM-EVB_PLATFORM.LCD-12(LCD0_D23/SMC_DET/PD23) LCD_CON.12
LCD_DE: A20-SOM-EVB_PLATFORM.LCD-32(LCD0_DE/SMC_RST/PD25) LCD_CON.32
LCD_HSYNC: A20-SOM-EVB_PLATFORM.LCD-29(LCD0_HSYNC/SMC_SLK/PD26) LCD_CON.29 R58.1
LCD_LEFT/RIGHT: A20-SOM-EVB_PLATFORM.LCD-33(LCD_LEFT/RIGHT) LCD_CON.33
LCD_PWR: A20-SOM-EVB_PLATFORM.LCD-35(LCD_PWR_EN/PH7) LCD_CON.35
LCD_UP/DOWN: A20-SOM-EVB_PLATFORM.LCD-34(LCD_UP/DOWN) LCD_CON.34
LCD_VSYNC: A20-SOM-EVB_PLATFORM.LCD-30(LCD0_VSYNC/SMC_SDA/PD27) LCD_CON.30 R54.1
LDO3_2.8V [pwr]: A20-SOM-EVB_PLATFORM.4-4(LDO3_2.8V) LDO3_2.8V_E.1
LINEINL: A20-SOM-EVB_PLATFORM.1-8(LINEINL) GPIO-1.8
LINEINR: A20-SOM-EVB_PLATFORM.1-6(LINEINR) GPIO-1.6
LRADC0: A20-SOM-EVB_PLATFORM.1-24(LRADC0) GPIO-1.24 R12.1
LRADC1: A20-SOM-EVB_PLATFORM.1-26(LRADC1) GPIO-1.26
MDI[0]+: LAN.1 U8.1(MDI[0]+)
MDI[0]-: LAN.2 U8.2(MDI[0]-)
MDI[1]+: LAN.3 U8.4(MDI[1]+)
MDI[1]-: LAN.4 U8.5(MDI[1]-)
MDI[2]+: LAN.7 U8.8(MDI[2]+)
MDI[2]-: LAN.8 U8.9(MDI[2]-)
MDI[3]+: LAN.9 U8.11(MDI[3]+)
MDI[3]-: LAN.10 U8.12(MDI[3]-)
MENU_BUT: GPIO-2.28 MENU.P$2 R14.2 R15.1
MIC1OUTN: A20-SOM-EVB_PLATFORM.1-20(MIC1OUTN) GPIO-1.20
MIC1OUTP: A20-SOM-EVB_PLATFORM.1-18(MIC1OUTP) GPIO-1.18
MICIN2: A20-SOM-EVB_PLATFORM.1-22(MICIN2) GPIO-1.22
MICROPHONE: A20-SOM-EVB_PLATFORM.1-16(MICROPHONE) GPIO-1.16 MIC_IN.2 MIC_IN.3
N$1: L2.2 USB_OTG.GND1 USB_OTG.GND2 USB_OTG.GND3 USB_OTG.GND4
N$2: R3.2 U1.3(ISET)
N$3: C3.1 C4.1 L1.2 R1.2 U1.1(OUT)
N$4: FET4.1(G) R54.2
N$5: FET5.1(G) R58.2
N$6: C45.1 U7.8(SS)
N$7: R37.2 U7.7(EN)
N$8: C32.1 U7.1(BS)
N$9: C32.2 L10.1 U7.3(SW)
N$10: C36.1 U7.6(COMP)
N$11: C36.2 R45.1
N$12: C71.2 LAN.SH1 LAN.SH2
N$13: R52.2 U8.46(RSET)
N$14: CAM1.3(SDA) FET3.2(S) R25.1
N$15: C62.2 Q1.2 U8.42(CKXTAL1)
N$16: C64.2 Q1.1 U8.43(CKXTAL2)
N$17: L14.1 U8.48(REG_OUT)
N$18: C59.2 LAN.5
N$19: C65.2 R57.2 R63.2 R64.2 U8.29(PHYRSTB)
N$20: C61.2 LAN.6
N$21: R60.1 R62.1 U8.38(RXDLY/LED_10/LED2)
N$22: LAN.12 R61.2
N$23: LAN.11 R59.2 U8.35(PHY_AD1/LED_1000/LED1)
N$24: R43.2 R44.2 U8.39(ENSWREG)
N$25: LAN.13 R47.2
N$26: C42.1 R42.1 U8.19(RXC)
N$27: R66.2 U8.32(CLK125)
N$28: R40.1 R41.1 U8.13(RXCTL/RXDV)
N$29: RM5.4.1 U8.14(RXD[0])
N$30: R65.1 RM4.3.1 RM5.3.1 U8.16(RXD[1]/TXDLY)
N$31: RM4.2.1 RM5.2.1 U8.17(RXD[2]/AN0)
N$32: RM4.1.1 RM5.1.1 U8.18(RXD[3]/AN1)
N$33: CAM1.5(SCL) FET2.2(S) R24.1
N$34: CAM1.13(MCLK) RM1.2.1
N$35: CAM1.17(PCLK) RM1.1.1
N$36: CAM1.7(VSYNC) RM1.4.1
N$37: CAM1.9(HSYNC) RM1.3.1
N$38: CAM1.12(D9) RM2.2.1
N$39: CAM1.14(D8) RM2.1.1
N$40: CAM1.16(D7) RM3.1.1
N$41: CAM1.18(D6) RM3.2.1
N$42: CAM1.20(D5) RM3.3.1
N$43: CAM1.22(D4) RM3.4.1
N$44: CAM1.21(D3) RM2.3.1
N$45: CAM1.19(D2) RM2.4.1
N$46: LAN.14 R48.1 U8.34(PHY_AD0/LED_DUPLEX/LED0)
N$47: C7.2 R6.1
N$48: C8.2 R7.1
N$49: C6.2 R5.1
N$50: HEADPHONES.5 L5.2
N$51: HEADPHONES.2 L4.2
N$52: HEADPHONES.3 L3.2
N$53: C25.1 R22.1 R23.2 T1.1(B)
N$54: FET1.1(G) R20.2 T1.3(C)
N$55: 5V_E_SATA.2 5V_SATA_PWR.1 C21.2 C22.2 FET1.3(D)
N$56: D2.C UART0.2
N$57: +5V/3.3V.2 C29.1 VR1.1(VIN) VR1.3(CE)
N$58: GPIO-3.4 PB9/GND.2
N$59: PC17/PB9.2 R2.2 U1.4(EN)
N$62: R38.1 R46.1 U7.5(FB)
N$101: R9.2 U2.3(ISET)
N$106: C17.2 SATA.2(A+)
N$111: C9.1 L6.2 USB_HOST.1.1
N$112: C18.2 SATA.3(A-)
N$113: C19.2 SATA.5(B-)
N$114: C20.2 SATA.6(B+)
N$129: PWR_LED.A R39.2
N$137: R11.2 U3.3(ISET)
N$161: R55.1 SD/MMC.CD(CP)
N$192: C10.1 C11.1 C67.+ C222.+ L6.1 U2.1(OUT)
N$193: L8.2 USB_HOST.GND1 USB_HOST.GND2 USB_HOST.GND3 USB_HOST.GND4
N$194: C13.1 L7.2 USB_HOST.2.1
N$195: C15.1 C16.1 C68.+ C69.+ L7.1 U3.1(OUT)
NALE: A20-SOM-EVB_PLATFORM.5-36(NALE/SPI0_MISO/PC1) GPIO-4.16
NCE0: A20-SOM-EVB_PLATFORM.5-40(NCE0/PC4) GPIO-4.20
NCLE: A20-SOM-EVB_PLATFORM.5-34(NCLE/SPI0_CLK/PC2) GPIO-4.14
NDQ0: A20-SOM-EVB_PLATFORM.5-25(NDQ0/SDC2_D0/PC8) GPIO-4.5
NDQ1: A20-SOM-EVB_PLATFORM.5-27(NDQ1/SDC2_D1/PC9) GPIO-4.7
NDQ2: A20-SOM-EVB_PLATFORM.5-29(NDQ2/SDC2_D2/PC10) GPIO-4.9
NDQ3: A20-SOM-EVB_PLATFORM.5-31(NDQ3/SDC2_D3/PC11) GPIO-4.11
NDQ4: A20-SOM-EVB_PLATFORM.5-33(NDQ4/PC12) GPIO-4.13
NDQ5: A20-SOM-EVB_PLATFORM.5-35(NDQ5/PC13) GPIO-4.15
NDQ6: A20-SOM-EVB_PLATFORM.5-37(NDQ6/PC14) GPIO-4.17
NDQ7: A20-SOM-EVB_PLATFORM.5-39(NDQ7/PC15) GPIO-4.19
NMI_N: A20-SOM-EVB_PLATFORM.4-38(NMI#) GPIO-2.22
NRB0: A20-SOM-EVB_PLATFORM.5-28(NRB0/SDC2_CMD/PC6) GPIO-4.8
NRE: A20-SOM-EVB_PLATFORM.5-30(NRE#/PC5) GPIO-4.10
NWE: A20-SOM-EVB_PLATFORM.5-38(NWE#/SPI0_MOSI/PC0) GPIO-4.18
PA9: A20-SOM-EVB_PLATFORM.2-35(ERXERR/SPI3_CS1/PA9) GPIO-2.34
PA14: A20-SOM-EVB_PLATFORM.2-34(ETXCK/UART7_TX/UART1_DTR/PA14) GPIO-2.32
PB3: A20-SOM-EVB_PLATFORM.3-6(IR0_TX/SPDIF_MCLK/STANBYWFI/PB3) GPIO-3.6
PB4: A20-SOM-EVB_PLATFORM.3-8(IR0_RX/PB4) GPIO-3.8
PB5: A20-SOM-EVB_PLATFORM.3-10(I2S_MCLK/AC97_MCLK/PB5) GPIO-3.10
PB6: A20-SOM-EVB_PLATFORM.3-12(I2S_BCLK/AC97_BCLK/PB6) GPIO-3.12
PB7: A20-SOM-EVB_PLATFORM.3-14(I2S_LRCK/AC97_SYNC/PB7) GPIO-3.14
PB8: A20-SOM-EVB_PLATFORM.3-16(I2S_DO0/AC97_DO/PB8) GPIO-3.16
PB10: A20-SOM-EVB_PLATFORM.3-18(I2S_DO2/PB10) GPIO-3.18
PB11: A20-SOM-EVB_PLATFORM.3-20(I2S_DO3/PB11) GPIO-3.20
PB12: A20-SOM-EVB_PLATFORM.3-22(I2S_DI/AC97_DI/SPDIF_DI/PB12) GPIO-3.22
PB13: A20-SOM-EVB_PLATFORM.3-24(SPI2_CS1/SPDIF_DO/PB13) GPIO-3.24
PB14: A20-SOM-EVB_PLATFORM.3-26(JTAG_MS0/SPI2_CS0/PB14) GPIO-3.26
PB15: A20-SOM-EVB_PLATFORM.3-28(JTAG_CK0/SPI2_CLK/PB15) GPIO-3.28
PB16: A20-SOM-EVB_PLATFORM.3-30(JTAG_DO0/SPI2_MOSI/PB16) GPIO-3.30
PB17: A20-SOM-EVB_PLATFORM.3-32(JTAG_DI0/SPI2_MISO/PB17) GPIO-3.32
PB18/TWI1-SCK: A20-SOM-EVB_PLATFORM.4-21(TWI1_SCK/PB18) FET2.3(D) UEXT2.5
PB19/TWI1-SDA: A20-SOM-EVB_PLATFORM.4-22(TWI1_SDA/PB19) FET3.3(D) UEXT2.6
PC3/SATA-PWR-EN: A20-SOM-EVB_PLATFORM.5-32(NCE1/PC3) GPIO-4.12 R22.2
PC7/NRB1: A20-SOM-EVB_PLATFORM.5-26(NRB1/SDC2_CLK/PC7) GPIO-4.6
PC16/CAM-PWR-EN: A20-SOM-EVB_PLATFORM.5-16(PC16/CAM-PWR-EN) GPIO-3.5 VR2.3(CE)
PC18: A20-SOM-EVB_PLATFORM.5-20(NCE3/PC18) GPIO-4.24
PC23: A20-SOM-EVB_PLATFORM.5-22(SPI0_CS0/PC23) GPIO-4.23
PC24/NQS: A20-SOM-EVB_PLATFORM.5-24(NDQS/PC24) GPIO-4.21
PE0/CSI0_PCLK: A20-SOM-EVB_PLATFORM.4-6(TS0_CLK/CSI0_PCLK/PE0) GPIO-2.6 RM1.1.2
PE1/CSI0_MCLK: A20-SOM-EVB_PLATFORM.4-8(TS0_ERR/CSI0_MCLK/PE1) GPIO-2.8 RM1.2.2
PE2/CSI0_HSYNC: A20-SOM-EVB_PLATFORM.4-10(TS0_SYNC/CSI0_HSYNC/PE2) GPIO-2.10 RM1.3.2
PE3/CSI0_VSYNC: A20-SOM-EVB_PLATFORM.4-12(TS0_DVLD/CSI0_VSYNC/PE3) GPIO-2.12 RM1.4.2
PE4/CSI0_D0: A20-SOM-EVB_PLATFORM.4-14(TS0_D0/CSI0_D0/PE4) GPIO-2.14 RM2.4.2
PE5/CSI0_D1: A20-SOM-EVB_PLATFORM.4-16(TS0_D1/CSI0_D1/PE5) GPIO-2.16 RM2.3.2
PE6/CSI0_D2: A20-SOM-EVB_PLATFORM.4-18(TS0_D2/CSI0_D2/PE6) GPIO-2.18 RM3.4.2
PE7/CSI0_D3: A20-SOM-EVB_PLATFORM.4-9(TS0_D3/CSI0_D3/PE7) GPIO-2.9 RM3.3.2
PE8/CSI0_D4: A20-SOM-EVB_PLATFORM.4-11(TS0_D4/CSI0_D4/PE8) GPIO-2.11 RM3.2.2
PE9/CSI0_D5: A20-SOM-EVB_PLATFORM.4-13(TS0_D5/CSI0_D5/PE9) GPIO-2.13 RM3.1.2
PE10/CSI0_D6: A20-SOM-EVB_PLATFORM.4-15(TS0_D6/CSI0_D6/PE10) GPIO-2.15 RM2.1.2
PE11/CSI0_D7: A20-SOM-EVB_PLATFORM.4-17(TS0_D7/CSI0_D7/PE11) GPIO-2.17 RM2.2.2
PG0: A20-SOM-EVB_PLATFORM.5-1(TS1_CLK/CSI1_PCLK/SDC1_CMD/PG0) GPIO-1.5
PG1: A20-SOM-EVB_PLATFORM.5-3(TS1_ERR/CSI1_MLCK/SDC1_CLK/PG1) GPIO-1.7
PG2: A20-SOM-EVB_PLATFORM.5-5(TS1_SYNC/CSI1_HSYNC/SDC1_D0/PG2) GPIO-1.9
PG3: A20-SOM-EVB_PLATFORM.5-7(TS1_DVLD/CSI1_VSYNC/SDC1_D1/PG3) GPIO-1.11
PG4: A20-SOM-EVB_PLATFORM.5-9(TS1_D0/CSI1_D0/SDC1_D2/CSI0_D8/PG4) GPIO-1.13
PG5: A20-SOM-EVB_PLATFORM.5-11(TS1_D1/CSI1_D1/SDC1_D3/CSI0_D9/PG5) GPIO-1.15
PG6: A20-SOM-EVB_PLATFORM.5-13(TS1_D2/CSI1_D2/UART3_TX/CSI0_D10/PG6) GPIO-1.17
PG7: A20-SOM-EVB_PLATFORM.5-15(TS1_D3/CSI1_D3/UART3_RX/CSI0_D11/PG7) GPIO-1.19
PG8: A20-SOM-EVB_PLATFORM.5-17(TS1_D4/CSI1_D4/UART3_RTS/CSI0_D12/PG8) GPIO-1.21
PG9: A20-SOM-EVB_PLATFORM.5-19(TS1_D5/CSI1_D5/UART3_CTS/CSI0_D13/PG9) GPIO-1.23
PG10: A20-SOM-EVB_PLATFORM.5-21(TS1_D6/CSI1_D6/UART4_TX/CSI0_D14/PG10) GPIO-1.25
PG11: A20-SOM-EVB_PLATFORM.5-23(TS1_D7/CSI1_D7/UART4_RX/CSI0_D15/PG11) GPIO-1.27
PH0/SDC3-DET#: A20-SOM-EVB_PLATFORM.3-5(LCD1_D0/ATAA0/UART3_TX/EINT0/CSI1_D0/PH0) R55.2 RM6.1.1
PH2/LED: A20-SOM-EVB_PLATFORM.3-7(LCD1_D2/ATAA2/UART3_RTS/EINT2/CSI1_D2/PH2) GPIO-3.7
PH8: A20-SOM-EVB_PLATFORM.3-9(LCD1_D8/ATAD4/KP_IN0/MS_D0/EINT8/CSI1_D8/PH8) GPIO-3.9
PH9: A20-SOM-EVB_PLATFORM.3-11(LCD1_D9/ATAD5/KP_IN1/MS_D1/EINT9/CSI1_D9/PH9) GPIO-3.11
PH10: A20-SOM-EVB_PLATFORM.3-13(LCD1_D10/ATAD6/KP_IN2/MS_D2/EINT10/CSI1_D10/PH10) GPIO-3.13
PH11: A20-SOM-EVB_PLATFORM.3-15(LCD1_D11/ATAD7/KP_IN3/MS_D3/EINT11/CSI1_D11/PH11) GPIO-3.15
PH12/CSI-STY-1: A20-SOM-EVB_PLATFORM.3-17(LCD1_D12/ATAD8/PS2_SCK1/EINT12/CSI1_D12/PH12) CAM1.8(PWDN) GPIO-3.17 R21.1
PH13/CSI-RST-1: A20-SOM-EVB_PLATFORM.3-19(LCD1_D13/ATAD9/PS2_SDA1/SMC_RST/EINT13/CSI1_D13/PH13) CAM1.6(RST) GPIO-3.19 R19.1
PH14: A20-SOM-EVB_PLATFORM.3-21(LCD1_D14/ATAD10/KP_IN4/SMC_VPPEN/EINT14/CSI1_D14/PH14) GPIO-3.21
PH15 [pwr]: A20-SOM-EVB_PLATFORM.3-23(LCD1_D15/ATAD11/KP_IN5/SMC_VPPPP/EINT15/CSI1_D15/PH15) GPIO-3.23
PH16: A20-SOM-EVB_PLATFORM.3-25(LCD1_D16/ATAD12/KP_IN6/SMC_DET/EINT16/CSI1_D16/PH16) GPIO-3.25
PH17: A20-SOM-EVB_PLATFORM.3-27(LCD1_D17/ATAD13/KP_IN7/SMC_VCCEN/EINT17/CSI1_D17/PH17) GPIO-3.27
PH18: A20-SOM-EVB_PLATFORM.3-29(LCD1_D18/ATAD14/KP_OUT0/SMC_SLK/EINT18/CSI1_D18/PH18) GPIO-3.29
PH19: A20-SOM-EVB_PLATFORM.3-31(LCD1_D19/ATAD15/KP_OUT1/SMC_SDA/EINT19/CSI1_D19/PH19) GPIO-3.31
PH20: A20-SOM-EVB_PLATFORM.3-33(LCD1_D20/ATAOE/CAN_TX/EINT20/CSI1_D20/PH20) GPIO-3.33
PH21: A20-SOM-EVB_PLATFORM.3-35(LCD1_D21/ATADREQ/CAN_RX/EINT21/CSI1_D21/PH21) GPIO-3.35
PH22: A20-SOM-EVB_PLATFORM.3-37(LCD1_D22/ATADACK/KP_OUT2/SDC1_CMD/CSI1_D22/PH22) GPIO-3.37
PH23: A20-SOM-EVB_PLATFORM.3-39(LCD1_D23/ATACS0/KP_OUT3/SDC1_CLK/CSI1_D23/PH23) GPIO-3.39
PH24: A20-SOM-EVB_PLATFORM.3-34(LCD1_CLK/ATACS1/KP_OUT4/SDC1_D0/CSI1_PCLK/PH24) GPIO-3.34
PH25: A20-SOM-EVB_PLATFORM.3-36(LCD1_DE/ATAIORDY/KP_OUT5/SDC1_D1/CSI1_FIELD/PH25) GPIO-3.36
PH26: A20-SOM-EVB_PLATFORM.3-38(LCD1_HSYNC/ATAIOR/KP_OUT6/SDC1_D2/CSI1_HSYNC/PH26) GPIO-3.38
PH27: A20-SOM-EVB_PLATFORM.3-40(LCD1_VSYNC/ATAIOW/KP_OUT7/SDC1_D3/CSI1_VSYNC/PH27) GPIO-3.40
PI0: A20-SOM-EVB_PLATFORM.1-29(GPS_CLK/PI0) GPIO-1.29
PI1: A20-SOM-EVB_PLATFORM.1-31(GPS_SIGN/PI1) GPIO-1.31
PI2: A20-SOM-EVB_PLATFORM.1-33(GPS_MAG/PI2) GPIO-1.33
PI3: A20-SOM-EVB_PLATFORM.1-35(PWM1/PI3) GPIO-1.35
PI10: A20-SOM-EVB_PLATFORM.1-37(SPI0_CS0/UART5_TX/EINT22/PI10) GPIO-1.37
PI11: A20-SOM-EVB_PLATFORM.1-39(SPI0_CLK/UART5_RX/EINT23/PI11) GPIO-1.39
PI14: A20-SOM-EVB_PLATFORM.1-40(PS2_SCK1/TCLKIN0/EINT26/SPI0_CS1/PI14) GPIO-1.40
PI15: A20-SOM-EVB_PLATFORM.4-36(PS2_SDA1/TCLKIN1/EINT27/SPI1_CS1/PI15) GPIO-2.20
RESET_N: A20-SOM-EVB_PLATFORM.4-40(RESET#) GPIO-2.24 R63.1
SATA-RXM: A20-SOM-EVB_PLATFORM.2-9(SATA-RXM) C19.1
SATA-RXP: A20-SOM-EVB_PLATFORM.2-11(SATA-RXP) C20.1
SATA-TXM: A20-SOM-EVB_PLATFORM.2-7(SATA-TXM) C18.1
SATA-TXP: A20-SOM-EVB_PLATFORM.2-5(SATA-TXP) C17.1
SD_VCC1: C60.2 C63.2 L15.2 SD/MMC.4(VDD)
SDC3-CLK: A20-SOM-EVB_PLATFORM.5-14(SDC3_CLK/PI5) SD/MMC.5(CLK/SCLK)
SDC3-CMD: A20-SOM-EVB_PLATFORM.5-12(SDC3_CMD/PI4) R51.1 SD/MMC.2(CMD/DI)
SDC3-D0: A20-SOM-EVB_PLATFORM.5-4(SDC3_D0/PI6) RM6.3.1 SD/MMC.7(DAT0/DO)
SDC3-D1: A20-SOM-EVB_PLATFORM.5-6(SDC3_D1/PI7) RM6.2.1 SD/MMC.8(DAT1/RES)
SDC3-D2: A20-SOM-EVB_PLATFORM.5-8(SDC3_D2/PI8) RM6.4.1 SD/MMC.9(DAT2/RES)
SDC3-D3: A20-SOM-EVB_PLATFORM.5-10(SDC3_D3/PI9) R50.1 SD/MMC.1(CD/DAT3/CS)
SEARCH_BUT: R15.2 R16.1 SEARCH.P$2
SPI1-CLK: A20-SOM-EVB_PLATFORM.4-25(EINT29/SPI1_CLK/UART2_CTS/PI17) UEXT2.9
SPI1-CS0: A20-SOM-EVB_PLATFORM.4-26(EINT28/SPI1_CS0/UART2_RTS/PI16) UEXT2.10
SPI1-MISO: A20-SOM-EVB_PLATFORM.4-23(EINT31/SPI1_MISO/UART2_RX/PI19) UEXT2.7
SPI1-MOSI: A20-SOM-EVB_PLATFORM.4-24(EINT30/SPI1_MOSI/UART2_TX/PI18) UEXT2.8
SPI2-CLK: A20-SOM-EVB_PLATFORM.4-33(NCE5/SPI2_CLK/PC20) UEXT1.9
SPI2-CS0: A20-SOM-EVB_PLATFORM.4-34(NCE4/SPI2_CS0/PC19) UEXT1.10
SPI2-MISO: A20-SOM-EVB_PLATFORM.4-31(NCE7/SPI2_MISO/PC22) UEXT1.7
SPI2-MOSI: A20-SOM-EVB_PLATFORM.4-32(NCE6/SPI2_MOSI/PC21) UEXT1.8
TPX1: A20-SOM-EVB_PLATFORM.LCD-37(TPX1) LCD_CON.37
TPX2: A20-SOM-EVB_PLATFORM.LCD-38(TPX2) LCD_CON.38
TPY1: A20-SOM-EVB_PLATFORM.LCD-39(TPY1) LCD_CON.39
TPY2: A20-SOM-EVB_PLATFORM.LCD-40(TPY2) LCD_CON.40
TVIN0: A20-SOM-EVB_PLATFORM.1-28(TVIN0) GPIO-1.28
TVIN1: A20-SOM-EVB_PLATFORM.1-30(TVIN1) GPIO-1.30
TVOUT3: A20-SOM-EVB_PLATFORM.1-32(TVOUT3) GPIO-1.32
TWI0-SCK: A20-SOM-EVB_PLATFORM.4-5(TWI0_SCK/PB0) GPIO-2.5
TWI0-SDA: A20-SOM-EVB_PLATFORM.4-7(TWI0_SDA/PB1) GPIO-2.7
TWI2-SCK: A20-SOM-EVB_PLATFORM.4-29(TWI2_SCK/PB20) UEXT1.5
TWI2-SDA: A20-SOM-EVB_PLATFORM.4-30(TWI2_SDA/PB21) UEXT1.6
UART0-RX: A20-SOM-EVB_PLATFORM.2-22(UART0_RX/IR1_RX/PB23) D2.A GPIO-2.26 R67.1
UART0-TX: A20-SOM-EVB_PLATFORM.2-21(UART0_TX/IR1_TX/PB22) GPIO-2.25 UART0.1
UART6-RX: A20-SOM-EVB_PLATFORM.4-28(SPI0_MISO/UART6_RX/EINT25/PI13) UEXT1.4
UART6-TX: A20-SOM-EVB_PLATFORM.4-27(SPI0_MOSI/UART6_TX/EINT24/PI12) UEXT1.3
UART7-RX: A20-SOM-EVB_PLATFORM.4-20(HSDA/UART7_RX/PS2_SDA0/PI21) UEXT2.4
UART7-TX: A20-SOM-EVB_PLATFORM.4-19(HSCL/UART7_TX/PS2_SCK0/PI20) UEXT2.3
UDM0: A20-SOM-EVB_PLATFORM.1-19(UDM0) USB_OTG.D-
UDM1: A20-SOM-EVB_PLATFORM.1-23(UDM1) USB_HOST.1.2
UDM2: A20-SOM-EVB_PLATFORM.1-27(UDM2) USB_HOST.2.2
UDP0: A20-SOM-EVB_PLATFORM.1-17(UDP0) USB_OTG.D+
UDP1: A20-SOM-EVB_PLATFORM.1-21(UDP1) USB_HOST.1.3
UDP2: A20-SOM-EVB_PLATFORM.1-25(UDP2) USB_HOST.2.3
USB0-DRV/PB9: A20-SOM-EVB_PLATFORM.1-7(I2S_DO1/PB9) PB9/GND.3 PC17/PB9.1
USB0-DRV/PC17: A20-SOM-EVB_PLATFORM.5-18(NCE2/PC17) GPIO-4.22 PC17/PB9.3
USB0-IDDET: A20-SOM-EVB_PLATFORM.1-11(LCD1_D4/ATAD0/UART4_TX/EINT4/CSI1_D4/PH4) USB_OTG.ID
USB0-VBUSDET: A20-SOM-EVB_PLATFORM.1-9(LCD1_D5/ATAD1/UART4_RX/EINT5/CSI1_D5/PH5) C2.1 R1.1 R4.2
USB1-DRV [pwr]: A20-SOM-EVB_PLATFORM.1-13(LCD1_D6/ATAD2/UART5_TX/MS_BS/EINT6/CSI1_D6/PH6) R8.2 U2.4(EN)
USB2-DRV [pwr]: A20-SOM-EVB_PLATFORM.1-15(LCD1_D3/ATAIRQ/UART3_CTS/EINT3/CSI1_D3/PH3) R10.2 U3.4(EN)
VCC [pwr]: +5V/3.3V.1 A20-SOM-EVB_PLATFORM.3-3(3.3V) A20-SOM-EVB_PLATFORM.4-3(3.3V) A20-SOM-EVB_PLATFORM.LCD-3(3.3V) C31.1 GPIO-2.3 GPIO-3.3 GPIO-4.3 L11.1 L12.1 L13.1 L15.1 LCD_CON.3 R47.1 R48.2 R49.2 R50.2 R51.2 R62.2 R67.2 RM4.1.2 RM4.2.2 RM4.3.2 RM6.1.2 RM6.2.2 RM6.3.2 RM6.4.2 UEXT1.1 UEXT2.1 VR2.1(VIN) ; supply symbol labelled 3.3V
VDDREG: C48.2 C50.2 C51.2 L13.2 U8.44(VDDREG) U8.45(VDDREG)
VGA-B: A20-SOM-EVB_PLATFORM.1-36(TVOUT1/VGA-B) GPIO-1.36 VGA_DB15-F.3
VGA-G: A20-SOM-EVB_PLATFORM.1-38(TVOUT0/VGA-G) GPIO-1.38 VGA_DB15-F.2
VGA-R: A20-SOM-EVB_PLATFORM.1-34(TVOUT2/VGA-R) GPIO-1.34 VGA_DB15-F.1
VGA_HSYNC: FET5.3(D) R56.2 VGA_DB15-F.13
VGA_VSYNC: FET4.3(D) R53.2 VGA_DB15-F.14
VOL+_BUT: GPIO-2.27 R12.2 R13.1 VOL+.P$2
VOL-_BUT: GPIO-2.29 R13.2 R14.1 VOL-.P$2
VPP [pwr]: A20-SOM-EVB_PLATFORM.1-3(3.0VA) GPIO-1.3 ; supply symbol labelled 3.0VA
Unconnected: HDMI.14 HEADPHONES.1 HEADPHONES.4 MIC_IN.1 MIC_IN.4 RM4.4.1 RM4.4.2 VGA_DB15-F.4 VGA_DB15-F.9 VGA_DB15-F.11 VGA_DB15-F.12 VGA_DB15-F.15

## Buses
LCD_D[0..7],LCD_D[8..15],LCD_D[16..23],LCD_HSYNC,LCD_VSYNC,LCD_CLK,LCD_DE,LCD_LEFT/RIGHT,LCD_UP/DOWN,LCD_PWR,LCD_BKL,TPX[1..2],TPY[1..2]
HTX0P,HTX0N,HTX1P,HTX1N,HTX2P,HTX2N,HTXCP,HTXCN,HSCL,HSDA,HHPD,HCEC
MDI[0..3]
ETXD[0..3],ETXEN,ETXCK,ERXD[0..3],ERXDV,ERXCK,EMDC,EMDIO,CLK125
PC16,PH2/LED,PH[8..27],PB[3..8],PB[10..17]
PE[0..11],PI15,NMI_N,RESET_N,GPIO[1..3],TWI0-SCK,TWI0-SDA
PG[0..11]
NDQ[0..7],NCE0,NWE,NALE,NCLE,PC3/NCE1,NRE,NRB0,PC7/NRB1,PC24/NQS,PC23,PC18,PC17,PC16
PI[0..3],PI[10..11],PI14,VGA-R,VGA-G,VGA-B,TVOUT3,TVIN[0..2],LRADC[0..1],MIC1OUTN,MIC1OUTP,MICROPHONE,HPCOM,HPOUTR,HPOUTL,LINEINR,LINEINL
UDP[0..2],UDM[0..2],USB0-DRV,USB1-DRV,USB2-DRV,USB0-IDDET,USB0-VBUSDET,+5V_OTG_PWR
SATA-TXP,SATA-TXM,SATA-RXM,SATA-RXP

## Notes on the sheet
- USB-OTG | Audio out & Microphone
- Rs
- Iset = 6800/Rs
- Iset = 523mA
- USB-HOSTs
- Rs
- Iset = 6800/Rs
- Iset = 1000mA
- Buttons | UART
- Rs
- 0.19V | 0.39V | 0.60V | 0.80V | 0.98V | 1.18V | 1.4V
- Iset = 6800/Rs
- Iset = 523mA
- SATA
- Camera
- +
- -
- HDMI
- Extensions
- UEXTs
- Power Supply
- GIGABIT ETHERNET TRANSCEIVER
- Ra
- + | Rb | Wider than 40mils
- 6-16VDC | -
- LI-ION_BATTERY | Wider than 60mils
- 4.2V
- Wider than 60mils | 5.0V | GND
- 3.3V | GND
- R0 | R1 | SD/MMC
- R2 | R3
- Vout=0.923x(1+Ra/Rb)
- R4 | R5
- R6 | R7
- G0 | G1
- G2 | G3
- G4 | G5
- G6 | G7
- VGA
- B0 | B1
- B2 | B3
- B4 | B5
- B6 | B7
- HSYNC | VSYNC
- CLK | DE
- L/R | U/D
- PWRE | BKL
- X1 | X2
- Y1 | Y2

## Power pins joined to a net without a drawn wire
GND: VGA_DB15-F.GND1 VGA_DB15-F.GND2

## Library data of the parts
1.8V 2.8V GND_PIN = gogo:TESTPAD: drill 40mils, diameter 70mils
5V_E_SATA LDO3_2.8V_E = jumper:SJ: SMD solder JUMPER
5V_SATA_PWR LIPO_BAT = Penko:CON2
+5V/3.3V PB9/GND PC17/PB9 = jumper:SJ2W: SMD solder JUMPER
A20-SOM-EVB_PLATFORM = OLIMEX_CASES:A20-SOM-EVB
C1-C43 C45-C66 C71 = rcl:C-EU: CAPACITOR, European symbol
C44 C67-C70 C126 C222 = rcl:CPOL-EU: POLARIZED CAPACITOR, European symbol
CAM1 = OLIMEX_CONNECTORS:CAMERA_2M-GT2005
D1 = OLIMEX_DISCRET:SMBJ16A
D2 = gogo:SCHOTKKY7.62SS
ENTER ESC HOME MENU SEARCH VOL+ VOL- = gogo:SW-TAKT
FET1 = Penko:P-MOS+DIOD
FET2-FET5 = Penko:N-MOS+DIOD
FID1-FID3 = SparkFunEagle-6-6-07:FIDUCIAL: Fiducial Alignment Points Various fiducial points for machine vision alignment.
FUSE1 = gogo:FUSE
GPIO-1 GPIO-3 LCD_CON = con-harting-ml:ML40: HARTING
GPIO-2 = con-harting-ml:ML34: HARTING
GPIO-4 = con-harting-ml:ML26: HARTING
HDMI = OLIMEX_CONNECTORS:HDMI-MC34931
HEADPHONES MIC_IN = gogo:AUDIO_JACK_5PIN
L1-L9 L11-L13 L15 = rcl:L-US: INDUCTOR, American symbol
L10 L14 = OLIMEX_DISCRET:L
LAN = OLIMEX_CONNECTORS:TM211Q01FM22_SH
PWR = gogo:PWR-JAK
PWR_LED = DOUBLE-SIDE:LED
Q1 = crystal:HC49/S: CRYSTAL
R1-R28 R37-R67 = rcl:R-EU_: RESISTOR, European symbol
RM1-RM6 = OLIMEX_DISCRET:R_MATRIX_4E
SATA = OLIMEX_CONNECTORS:SATA-PWA-07
SD/MMC = OLIMEX_CONNECTORS:SD_CARD
T1 = semicon-smd-ipc:NPN-TRANSISTOR_: NPN TRANSISTOR
U1-U3 = OLIMEX_IC:SY6280
U4-U6 = OLIMEX_IC:RCLAMP0524P
U7 = OLIMEX_IC:MP1482
U8 = OLIMEX_IC:RTL8211CL-GR: RTL8211CL-GR INTEGRATED 10/100/1000 GIGABIT ETHERNET TRANSCEIVER This element was created by Penko Bozhkov
UART0 = Penko:CON3
UEXT1 UEXT2 = con-harting-ml:ML10: HARTING
USB_HOST = OLIMEX_CONNECTORS:USB_TWO_LEVEL
USB_OTG = OLIMEX_CONNECTORS:MINI_USB9
VGA_DB15-F = OLIMEX_CONNECTORS:DB15
VR1 VR2 = OLIMEX_DISCRET:AP1231